# Altium schematic sheet PC-104.SchDoc: Connectors - PC-104
size A4; CheckedBy: (not checked); Author: P. Kuligowski
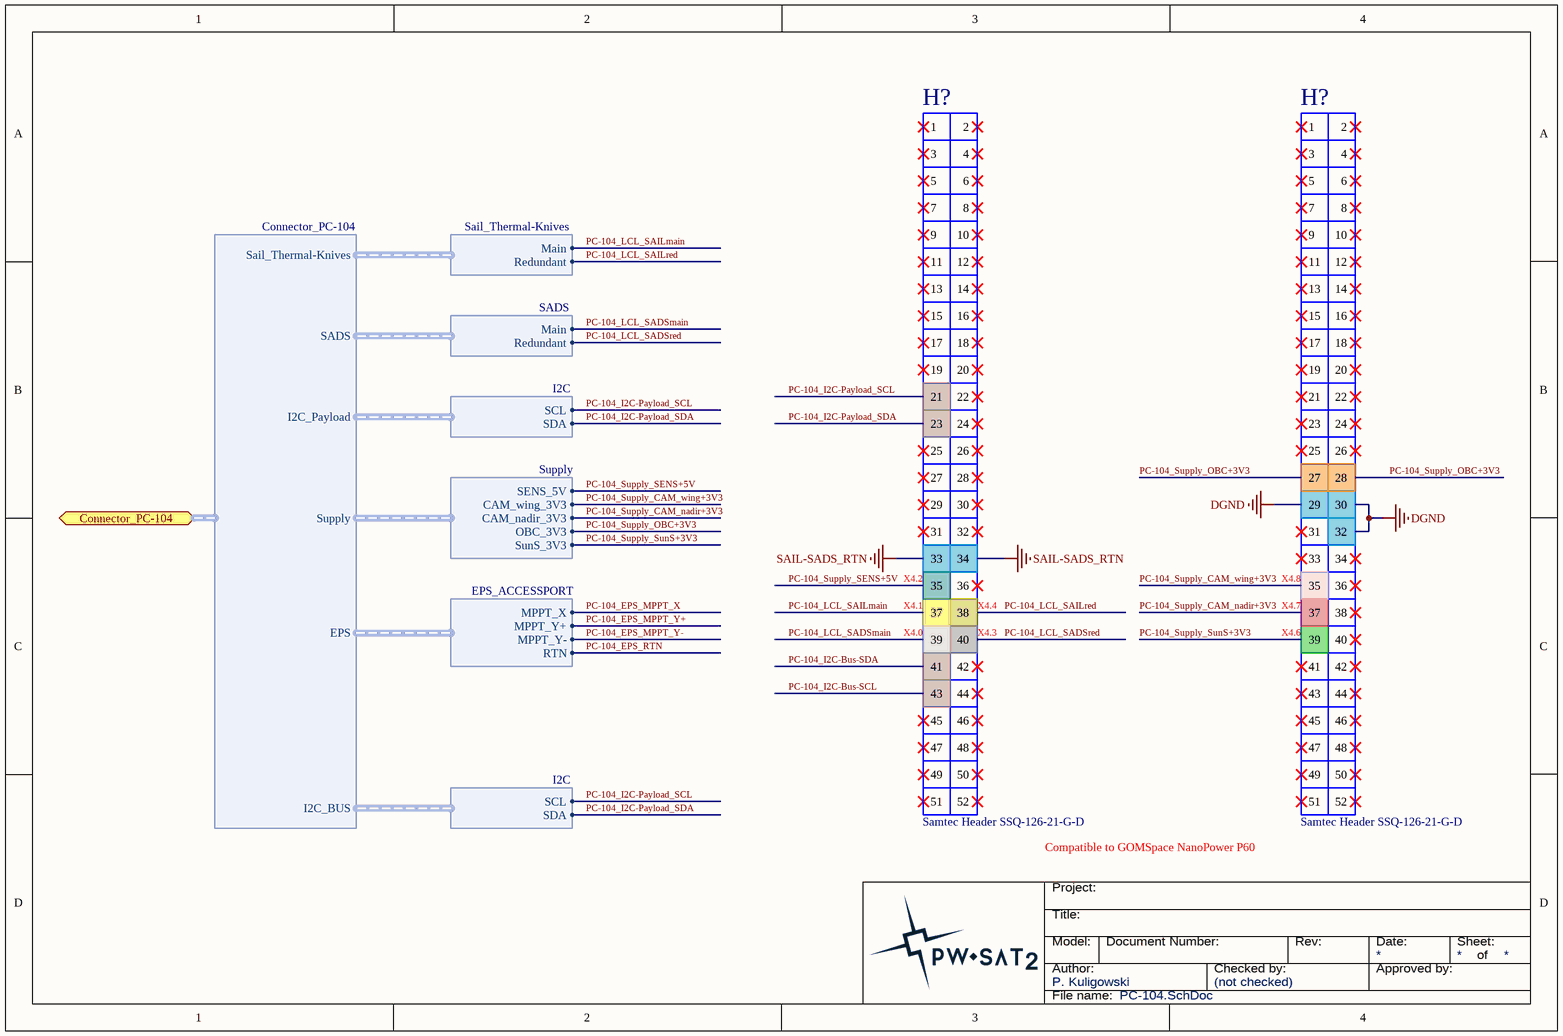
[diagram p0: PC-104.SchDoc]

## Parts
(Parts that share a designator on the sheet are numbered #1, #2 ... from top to bottom, then left to right.)
H?#1  Samtec Header SSQ-126-21-G-D  [Samtec_SSQ-126-21-G-D]
H?#2  Samtec Header SSQ-126-21-G-D  [Samtec_SSQ-126-21-G-D]

## Ports
Connector_PC-104 (harness Connector_PC-104)

## Harnesses
Connector_PC-104: I2C_Payload, Sail_Thermal-Knives, SADS, Supply, I2C_BUS, EPS
Supply: OBC_3V3, SunS_3V3, CAM_wing_3V3, SENS_5V, CAM_nadir_3V3
Sail_Thermal-Knives: Main, Redundant
SADS: Main, Redundant
I2C: SDA, SCL
EPS_ACCESSPORT: MPPT_X, MPPT_Y+, MPPT_Y-, RTN

## Nets
DGND: H?#2.29 H?#2.30 H?#2.32
SAIL-SADS_RTN: H?#1.33 H?#1.34
PC-104_EPS_MPPT_X: harness EPS_ACCESSPORT.MPPT_X
PC-104_EPS_MPPT_Y+: harness EPS_ACCESSPORT.MPPT_Y+
PC-104_EPS_MPPT_Y-: harness EPS_ACCESSPORT.MPPT_Y-
PC-104_EPS_RTN: harness EPS_ACCESSPORT.RTN
PC-104_I2C-Bus-SCL: H?#1.43
PC-104_I2C-Bus-SDA: H?#1.41
PC-104_I2C-Payload_SCL: H?#1.21 ; harness I2C.SCL
PC-104_I2C-Payload_SDA: H?#1.23 ; harness I2C.SDA
PC-104_LCL_SADSmain: H?#1.39 ; harness SADS.Main
PC-104_LCL_SADSred: H?#1.40 ; harness SADS.Redundant
PC-104_LCL_SAILmain: H?#1.37 ; harness Sail_Thermal-Knives.Main
PC-104_LCL_SAILred: H?#1.38 ; harness Sail_Thermal-Knives.Redundant
PC-104_Supply_CAM_nadir+3V3: H?#2.37 ; harness Supply.CAM_nadir_3V3
PC-104_Supply_CAM_wing+3V3: H?#2.35 ; harness Supply.CAM_wing_3V3
PC-104_Supply_OBC+3V3: H?#2.27 H?#2.28 ; harness Supply.OBC_3V3
PC-104_Supply_SENS+5V: H?#1.35 ; harness Supply.SENS_5V
PC-104_Supply_SunS+3V3: H?#2.39 ; harness Supply.SunS_3V3

Not connected (* = marked no-connect by the designer): H?#1 1* 2* 3* 4* 5* 6* 7* 8* 9* 10* 11* 12* 13* 14* 15* 16* 17* 18* 19* 20* 22* 24* 25* 26* 27* 28* 29* 30* 31* 32* 36* 42* 44* 45* 46* 47* 48* 49* 50* 51* 52*; H?#2 1* 2* 3* 4* 5* 6* 7* 8* 9* 10* 11* 12* 13* 14* 15* 16* 17* 18* 19* 20* 21* 22* 23* 24* 25* 26* 31* 33* 34* 36* 38* 40* 41* 42* 43* 44* 45* 46* 47* 48* 49* 50* 51* 52*

## Notes on the sheet
- (near H?#1) X4.2
- (near H?#2) X4.8
- (near H?#1) X4.1
- (near H?#1) X4.0
- (near H?#1) X4.4
- (near H?#1) X4.3
- (near H?#2) X4.7
- (near H?#2) X4.6
- Compatible to GOMSpace NanoPower P60
- Title:
- Project:
- Author:
- Model:
- Document Number:
- Checked by:
- Rev:
- Date:
- Approved by:
- Sheet:
- of
- File name:

## Library data of the parts
H?#1 H?#2 = Samtec_SSQ-126-xx-x-D: Samtec SSQ Series Header , 2.54mm pitch, 2x26pin. PC-104 Stack Connector.; HelpUrl: http://suddendocs.samtec.com/catalog_english/ssq_th.pdf; Value: Samtec Header SSQ-126-21-G-D